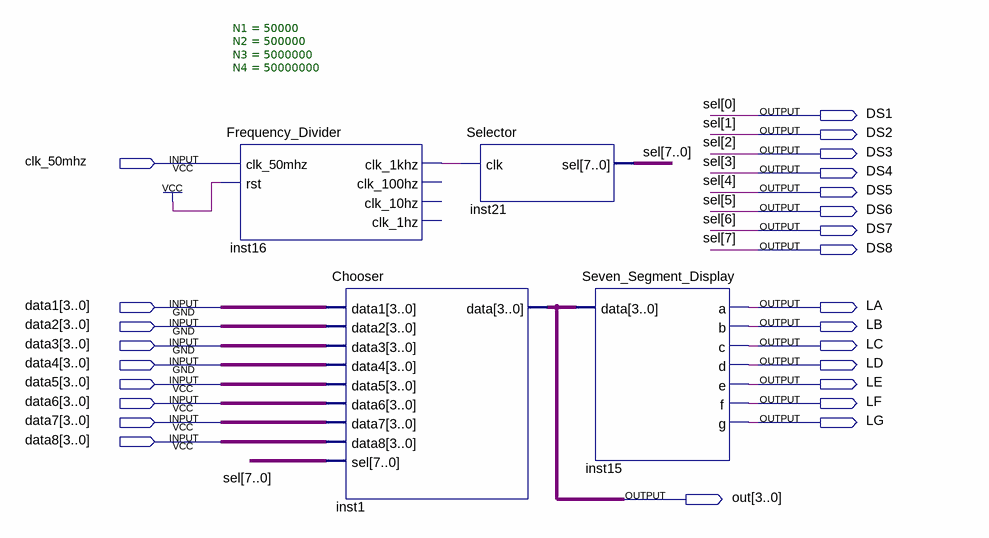
[diagram p0: schematic sheet]
// Quartus schematic Scanner.bdf as structural Verilog: 4 symbols, 25 pins
module Scanner (
  input  clk_50mhz,
  input  [3:0] data1,
  input  [3:0] data2,
  input  [3:0] data3,
  input  [3:0] data4,
  input  [3:0] data5,
  input  [3:0] data6,
  input  [3:0] data7,
  input  [3:0] data8,
  output DS1,
  output DS2,
  output DS3,
  output DS4,
  output DS5,
  output DS6,
  output DS7,
  output DS8,
  output LA,
  output LB,
  output LC,
  output LD,
  output LE,
  output LF,
  output LG,
  output [3:0] out
);

  wire inst16_clk_1khz;

  Frequency_Divider #(.N1(50000), .N2(500000), .N3(5000000), .N4(50000000)) inst16 (
    .clk_50mhz(clk_50mhz), .rst(1'b1), .clk_1khz(inst16_clk_1khz));  // open: clk_100hz, clk_10hz, clk_1hz
  Chooser inst1 (
    .data1(data1), .data2(data2), .data3(data3), .data4(data4), .data5(data5), .data6(data6), .data7(data7),
    .data8(data8), .sel({DS8, DS7, DS6, DS5, DS4, DS3, DS2, DS1}), .data(out));
  Selector inst21 (.clk(inst16_clk_1khz), .sel({DS8, DS7, DS6, DS5, DS4, DS3, DS2, DS1}));
  Seven_Segment_Display inst15 (.data(out), .a(LA), .b(LB), .c(LC), .d(LD), .e(LE), .f(LF), .g(LG));

  // Other names for the same wires on the sheet: sel[7:0] = {DS8, DS7, DS6, DS5, DS4, DS3, DS2, DS1}
endmodule
